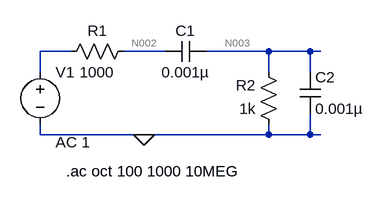
[diagram p0: schematic Draft17.asc]
Draft17.asc, the LTspice schematic file:
Version 4
SHEET 1 880 680
WIRE -80 80 -128 80
WIRE 64 80 0 80
WIRE 224 80 128 80
WIRE 288 80 224 80
WIRE 304 80 288 80
WIRE -128 112 -128 80
WIRE 224 112 224 80
WIRE 288 112 288 80
WIRE -128 208 -128 192
WIRE 32 208 -128 208
WIRE 224 208 224 192
WIRE 224 208 32 208
WIRE 288 208 288 176
WIRE 288 208 224 208
WIRE 304 208 288 208
FLAG 32 208 0
SYMBOL res 16 64 R90
WINDOW 0 0 56 VBottom 2
WINDOW 3 32 56 VTop 2
SYMATTR InstName R1
SYMATTR Value 1000
SYMBOL res 240 208 R180
WINDOW 0 36 76 Left 2
WINDOW 3 36 40 Left 2
SYMATTR InstName R2
SYMATTR Value 1k
SYMBOL voltage -128 96 R0
WINDOW 123 24 124 Left 2
WINDOW 39 0 0 Left 2
SYMATTR InstName V1
SYMATTR Value ""
SYMATTR Value2 AC 1
SYMBOL cap 128 64 R90
WINDOW 0 0 32 VBottom 2
WINDOW 3 32 32 VTop 2
SYMATTR InstName C1
SYMATTR Value 0.001µ
SYMBOL cap 272 112 R0
SYMATTR InstName C2
SYMATTR Value 0.001µ
TEXT -88 264 Left 2 !.ac oct 100 1000 10MEG

The netlist it stands for:
* Draft17.asc
R1 N002 N001 1000
R2 0 N003 1k
V1 N001 0 AC 1
C1 N003 N002 0.001µ
C2 N003 0 0.001µ
.ac oct 100 1000 10MEG
.backanno
.end

* Results of the author's LTspice run, read from the files saved beside the schematic
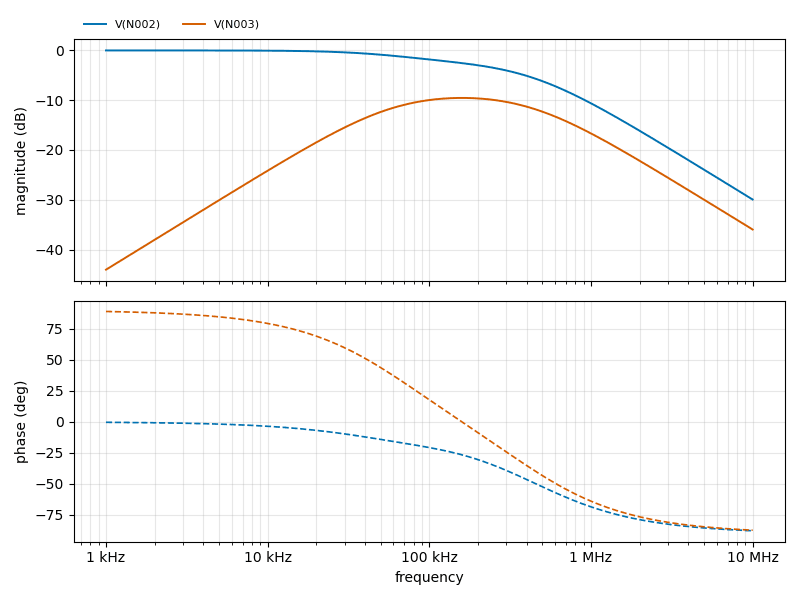
[diagram p1: AC Analysis of Draft17.asc, plotted from the saved traces]
* AC Analysis, 1 run:
*   V(N002): -0.00 dB at 1 kHz, -29.95 dB at 10 MHz, peak -0.00 dB at 1 kHz, 3 dB below the peak at 202.5 kHz
*   V(N003): -44.04 dB at 1 kHz, -35.97 dB at 10 MHz, peak -9.54 dB at 158.7 kHz, 3 dB below the peak at 48.19 kHz and 525.7 kHz